# EAGLE design bristol_longshot (EAGLE 7.3.0)
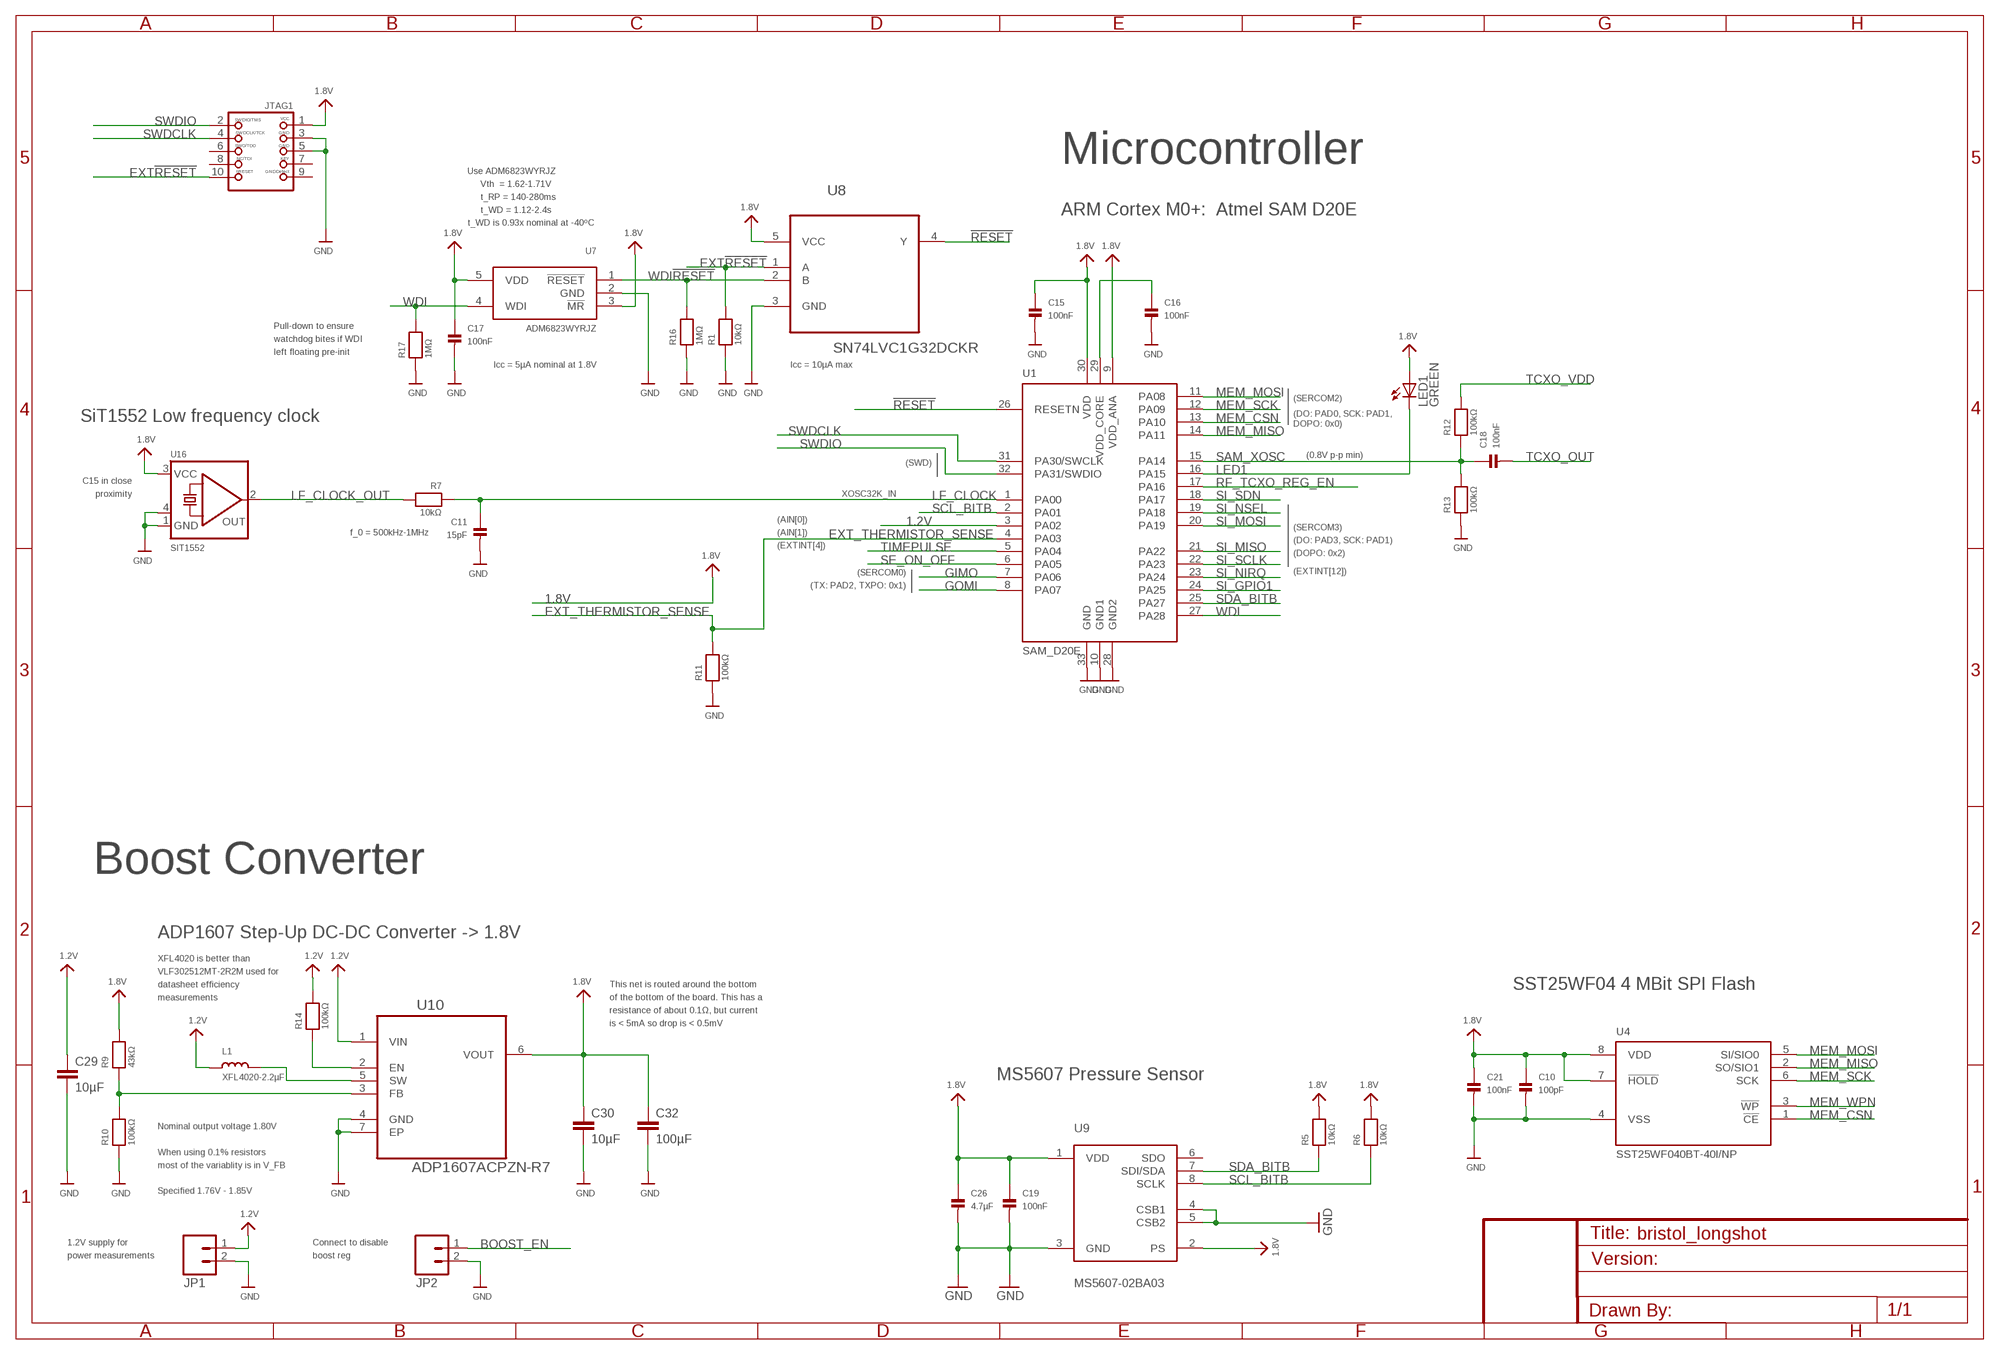
[diagram p0: schematic, sheet 1, part 1 of 2]
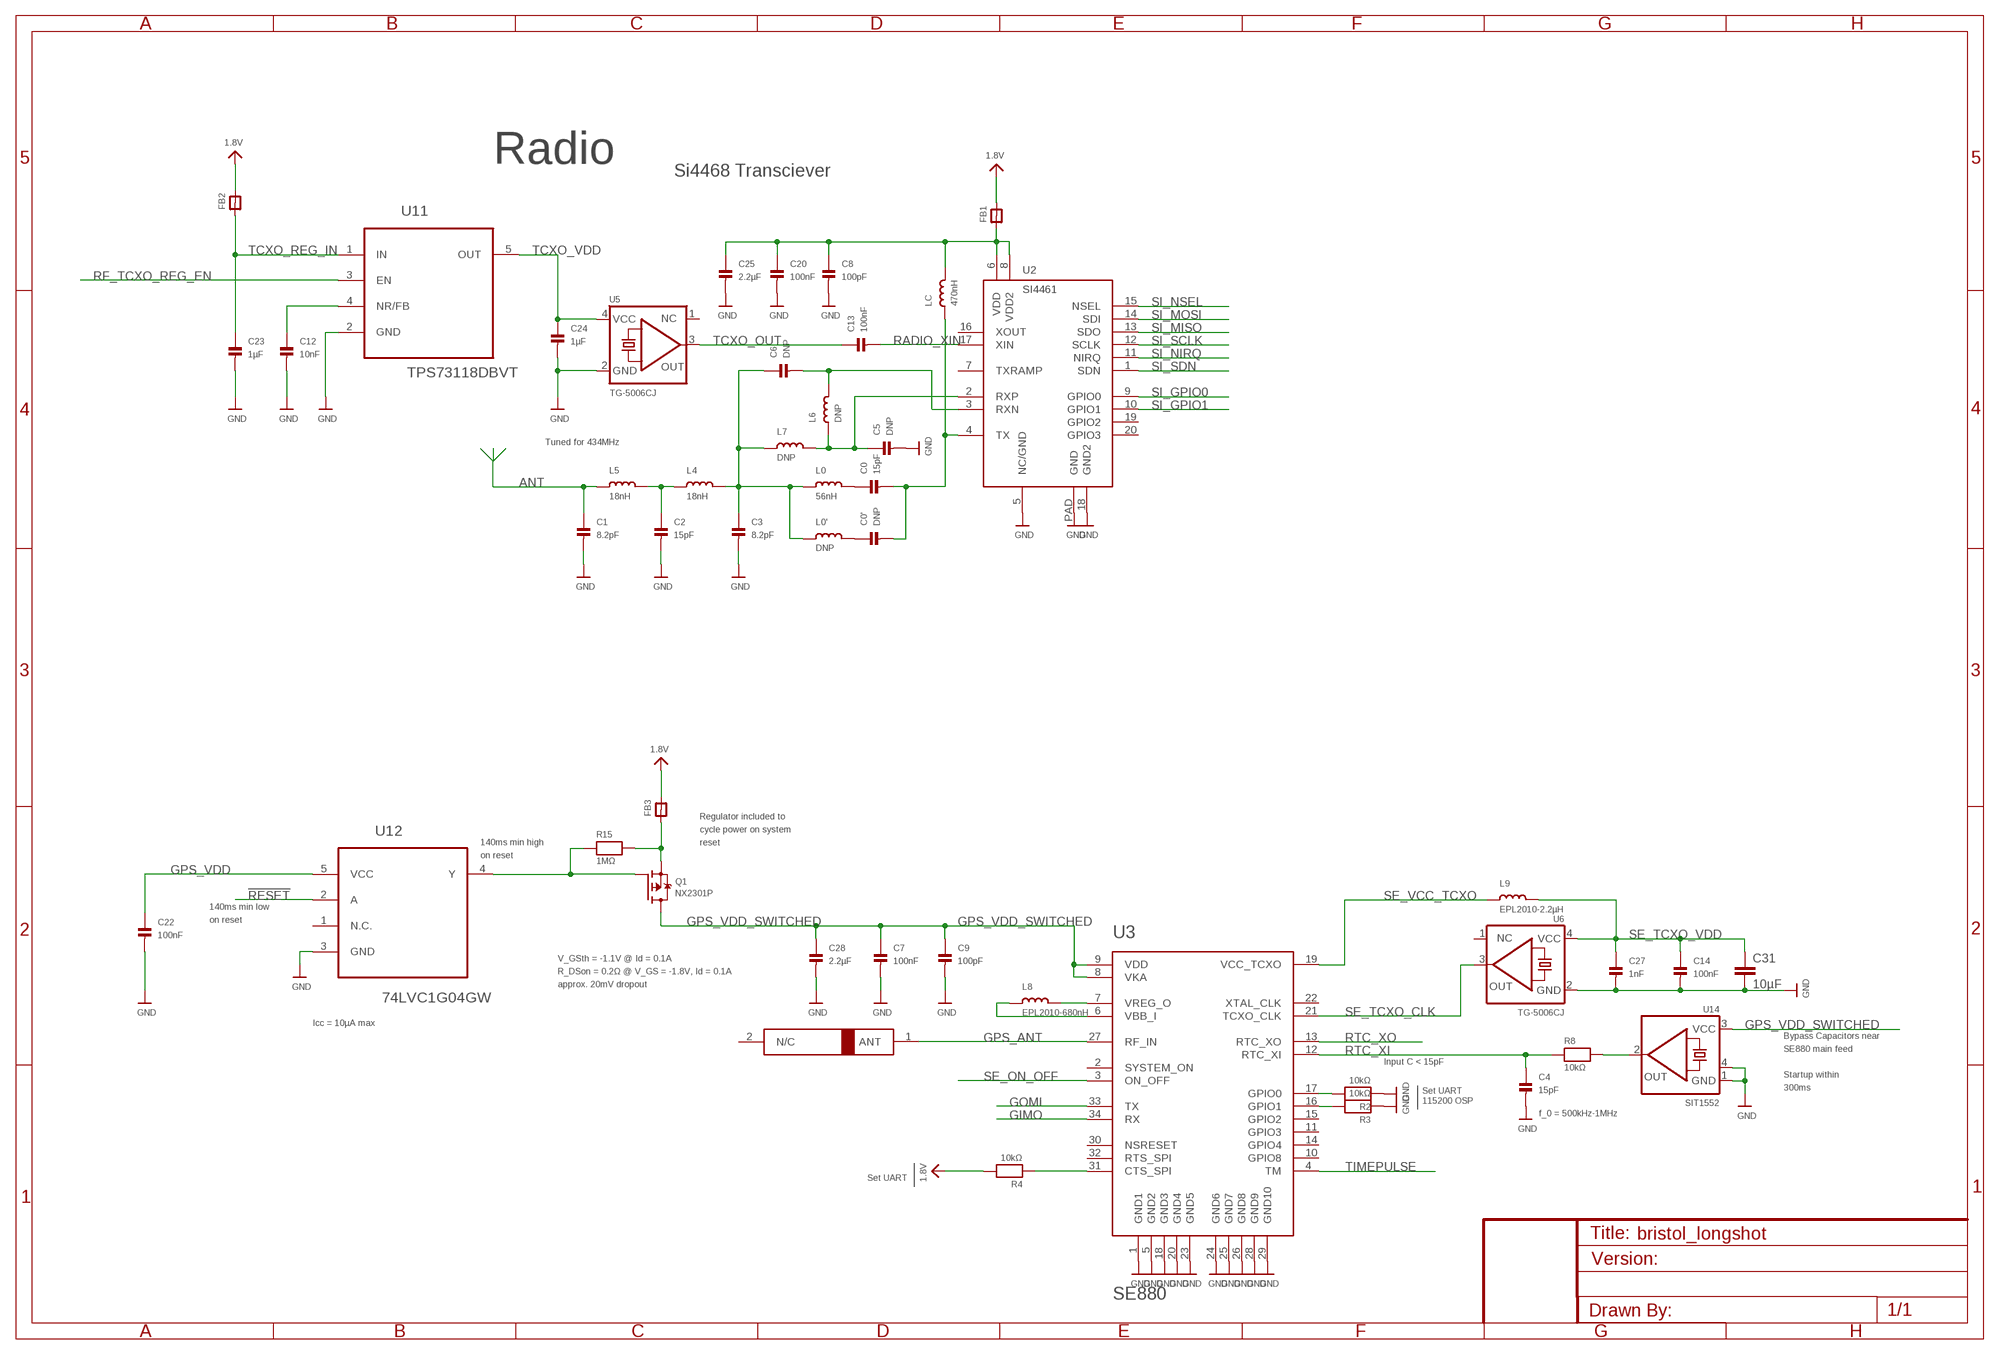
[diagram p1: schematic, sheet 1, part 2 of 2]

## Parts
A1  1575AT43A40  [1575AT43A40]
C0  15pF  CAP_CERAMIC_0402  [_0402]
C0'  DNP  CAP_CERAMIC_0402  [_0402]
C1  8.2pF  CAP_CERAMIC_0402  [_0402]
C2  15pF  CAP_CERAMIC_0402  [_0402]
C3  8.2pF  CAP_CERAMIC_0402  [_0402]
C4  15pF  CAP_CERAMIC_0402  [_0402]
C5  DNP  CAP_CERAMIC_0402  [_0402]
C6  DNP  CAP_CERAMIC_0402  [_0402]
C7  100nF  CAP_CERAMIC_0402  [_0402]
C8  100pF  CAP_CERAMIC_0402  [_0402]
C9  100pF  CAP_CERAMIC_0402  [_0402]
C10  100pF  CAP_CERAMIC_0402  [_0402]
C11  15pF  CAP_CERAMIC_0402  [_0402]
C12  10nF  CAP_CERAMIC_0402  [_0402]
C13  100nF  CAP_CERAMIC_0402  [_0402]
C14  100nF  CAP_CERAMIC_0402  [_0402]
C15  100nF  CAP_CERAMIC_0402  [_0402]
C16  100nF  CAP_CERAMIC_0402  [_0402]
C17  100nF  CAP_CERAMIC_0402  [_0402]
C18  100nF  CAP_CERAMIC_0402  [_0402]
C19  100nF  CAP_CERAMIC_0402  [_0402]
C20  100nF  CAP_CERAMIC_0402  [_0402]
C21  100nF  CAP_CERAMIC_0402  [_0402]
C22  100nF  CAP_CERAMIC_0402  [_0402]
C23  1µF  CAP_CERAMIC_0402  [_0402]
C24  1µF  CAP_CERAMIC_0402  [_0402]
C25  2.2µF  CAP_CERAMIC_0402  [_0402]
C26  4.7µF  CAP_CERAMIC_0402  [_0402]
C27  1nF  CAP_CERAMIC_0402  [_0402]
C28  2.2µF  CAP_CERAMIC_0402  [_0402]
C29  10µF  C-EUC0603K  [C0603K]
C30  10µF  C-EUC0603K  [C0603K]
C31  10µF  C-EUC0603K  [C0603K]
C32  100µF  C-EUC1206K  [C1206K]
FB1  FERRITE_0402  [_0402@1]
FB2  FERRITE_0402  [_0402@1]
FB3  FERRITE_0402  [_0402@1]
JP1  M02LOCK  [1X02_LOCK]
JP2  M02LOCK  [1X02_LOCK]
JTAG1  JTAG-CORTEXM3SMT  [2X05_1.27MM_SMT]
L0  56nH  INDUCTOR_0402  [_0402]
L0'  DNP  INDUCTOR_0402  [_0402]
L1  XFL4020-2.2µF  XFL4020  [XFL4020]
L4  18nH  INDUCTOR_0402  [_0402]
L5  18nH  INDUCTOR_0402  [_0402]
L6  DNP  INDUCTOR_0402  [_0402]
L7  DNP  INDUCTOR_0402  [_0402]
L8  EPL2010-680nH  EPL2010  [EPL2010]
L9  EPL2010-2.2µH  EPL2010  [EPL2010]
LC  470nH  INDUCTOR_0402  [_0402]
LED1  GREEN  LEDCHIPLED_0603  [CHIPLED_0603]
Q1  NX2301P  [SOT23]
R1  10kΩ  RESISTOR_0402  [_0402]
R2  10kΩ  RESISTOR_0402  [_0402]
R3  10kΩ  RESISTOR_0402  [_0402]
R4  10kΩ  RESISTOR_0402  [_0402]
R5  10kΩ  RESISTOR_0402  [_0402]
R6  10kΩ  RESISTOR_0402  [_0402]
R7  10kΩ  RESISTOR_0402  [_0402]
R8  10kΩ  RESISTOR_0402  [_0402]
R9  43kΩ  RESISTOR_0402  [_0402]
R10  100kΩ  RESISTOR_0402  [_0402]
R11  100kΩ  RESISTOR_0402  [_0402]
R12  100kΩ  RESISTOR_0402  [_0402]
R13  100kΩ  RESISTOR_0402  [_0402]
R14  100kΩ  RESISTOR_0402  [_0402]
R15  1MΩ  RESISTOR_0402  [_0402]
R16  1MΩ  RESISTOR_0402  [_0402]
R17  1MΩ  RESISTOR_0402  [_0402]
U1  SAM_D20E  [QFN32_5MM]
U2  SI4461  SI4060  [QFN20]
U3  SE880  [SE880]
U4  SST25WF040BT-40I/NP  [USON-8]
U5  TG-5006CJ  [TC-5006CJ]
U6  TG-5006CJ  [TC-5006CJ]
U7  ADM6823WYRJZ  TPS3123  [SOT23-5]
U8  SN74LVC1G32DCKR  [SOT65P210X110-5N]
U9  MS5607-02BA03  [MS5607-02BA03]
U10  ADP1607ACPZN-R7  [DFN200X200X60-7N]
U11  TPS73118DBVT  [SOT95P280X145-5N]
U12  74LVC1G04GW  [SOT65P210X110-5N]
U14  SIT1552  [SIT1552]
U16  SIT1552  [SIT1552]

## Nets
1.2V: C29.1 JP1.1 L1.1 R14.2 U1.3(PA02) U10.1(VIN)
1.8V: C10.1 C15.1 C17.1 C19.1 C21.1 C26.1 C30.1 C32.1 FB1.2 FB2.2 FB3.2 JTAG1.1 LED1.A R4.2 R5.2 R6.2 R9.2 U1.9(VDD_ANA) U1.30(VDD) U4.7(!HOLD) U4.8(VDD) U7.3(!MR) U7.5(VDD) U8.5(VCC) U9.1(VDD) U9.2(PS) U10.6(VOUT) U16.3(VCC)
!RESET: U1.26(RESETN) U8.4(Y) U12.2(A)
ANT: C1.1 L5.1
BOOST_EN: JP2.1 R14.1 U10.2(EN)
EXT!RESET: JTAG1.10 R1.2 U8.1(A)
EXT_THERMISTOR_SENSE: R11.2 U1.4(PA03)
FB: R9.1 R10.2 U10.3(FB)
FILTER1: C3.1 C6.1 L0'.1 L0.1 L4.2 L7.1
FILTER2: C2.1 L4.1 L5.2
GIMO: U1.7(PA06) U3.34(RX)
GND: C1.2 C2.2 C3.2 C4.2 C5.2 C7.2 C8.2 C9.2 C10.2 C11.2 C12.2 C14.2 C15.2 C16.2 C17.2 C19.2 C20.2 C21.2 C22.2 C23.2 C24.2 C25.2 C26.2 C27.2 C28.2 C29.2 C30.2 C31.2 C32.2 JP1.2 JP2.2 JTAG1.3 JTAG1.5 R1.1 R2.1 R3.1 R10.1 R11.1 R13.1 R16.1 R17.1 U1.10(GND1) U1.28(GND2) U1.33(GND) U2.5(NC/GND) U2.18(GND2) U2.PAD(GND) U3.1(GND1) U3.5(GND2) U3.18(GND3) U3.20(GND4) U3.23(GND5) U3.24(GND6) U3.25(GND7) U3.26(GND8) U3.28(GND9) U3.29(GND10) U4.4(VSS) U5.2(GND) U6.2(GND) U7.2(GND) U8.3(GND) U9.3(GND) U9.4(CSB1) U9.5(CSB2) U10.4(GND) U10.7(EP) U11.2(GND) U12.3(GND) U14.1(GND) U14.4(GND1) U16.1(GND) U16.4(GND1)
GOMI: U1.8(PA07) U3.33(TX)
GPS_ANT: A1.1(ANT) U3.27(RF_IN)
GPS_VDD: C22.1 FB3.1 Q1.2(S) R15.2 U12.5(VCC)
GPS_VDD_SWITCHED: C7.1 C9.1 C28.1 Q1.3(D) U3.8(VKA) U3.9(VDD) U14.3(VCC)
LED1: LED1.C U1.16(PA15)
LF_CLOCK: C11.1 R7.1 U1.1(PA00)
LF_CLOCK_OUT: R7.2 U16.2(OUT)
MEM_CSN: U1.13(PA10) U4.1(!CE)
MEM_MISO: U1.14(PA11) U4.2(SO/SIO1)
MEM_MOSI: U1.11(PA08) U4.5(SI/SIO0)
MEM_SCK: U1.12(PA09) U4.6(SCK)
MEM_WPN: U4.3(!WP)
N$5: C0'.1 L0'.2
RADIO_VDD: C8.1 C20.1 C25.1 FB1.1 LC.2 U2.6(VDD) U2.8(VDD2)
RADIO_XIN: C13.2 U2.17(XIN)
RESET: Q1.1(G) R15.1 U12.4(Y)
RF_OUT: C0'.2 C0.2 LC.1 U2.4(TX)
RF_TANK: C0.1 L0.2
RF_TCXO_REG_EN: U1.17(PA16) U11.3(EN)
RTC_XI: C4.1 R8.1 U3.12(RTC_XI)
RTC_XO: U3.13(RTC_XO)
RXN: C5.1 L6.1 L7.2 U2.2(RXP)
RXP: C6.2 L6.2 U2.3(RXN)
SAM_XOSC: C18.1 R12.1 R13.2 U1.15(PA14)
SCL_BITB: R6.1 U1.2(PA01) U9.8(SCLK)
SDA_BITB: R5.1 U1.25(PA27) U9.7(SDI/SDA)
SE800_LF_OUT: R8.2 U14.2(OUT)
SE_GPIO0: R2.2 U3.17(GPIO0)
SE_GPIO1: R3.2 U3.16(GPIO1)
SE_MODE_PULL: R4.1 U3.31(CTS_SPI)
SE_ON_OFF: U1.6(PA05) U3.3(ON_OFF)
SE_TCXO_CLK: U3.21(TCXO_CLK) U6.3(OUT)
SE_TCXO_VDD: C14.1 C27.1 C31.1 L9.2 U6.4(VCC)
SE_VBB: L8.1 U3.6(VBB_I)
SE_VCC_TCXO: L9.1 U3.19(VCC_TCXO)
SE_VREG: L8.2 U3.7(VREG_O)
SI_GPIO0: U2.9(GPIO0)
SI_GPIO1: U1.24(PA25) U2.10(GPIO1)
SI_MISO: U1.21(PA22) U2.13(SDO)
SI_MOSI: U1.20(PA19) U2.14(SDI)
SI_NIRQ: U1.23(PA24) U2.11(NIRQ)
SI_NSEL: U1.19(PA18) U2.15(NSEL)
SI_SCLK: U1.22(PA23) U2.12(SCLK)
SI_SDN: U1.18(PA17) U2.1(SDN)
SW: L1.2 U10.5(SW)
SWDCLK: JTAG1.4 U1.31(PA30/SWCLK)
SWDIO: JTAG1.2 U1.32(PA31/SWDIO)
TCXO_OUT: C13.1 C18.2 U5.3(OUT)
TCXO_REG_IN: C23.1 FB2.1 U11.1(IN)
TCXO_REG_NR: C12.1 U11.4(NR/FB)
TCXO_VDD: C24.1 R12.2 U5.4(VCC) U11.5(OUT)
TIMEPULSE: U1.5(PA04) U3.4(TM)
VDD_CORE: C16.1 U1.29(VDD_CORE)
WDI: R17.2 U1.27(PA28) U7.4(WDI)
WDI!RESET: R16.2 U7.1(!RESET) U8.2(B)
Unconnected: A1.2(N/C) JTAG1.6 JTAG1.7 JTAG1.8 JTAG1.9 U2.7(TXRAMP) U2.16(XOUT) U2.19(GPIO2) U2.20(GPIO3) U3.2(SYSTEM_ON) U3.10(GPIO8) U3.11(GPIO3) U3.14(GPIO4) U3.15(GPIO2) U3.22(XTAL_CLK) U3.30(NSRESET) U3.32(RTS_SPI) U5.1(NC) U6.1(NC) U9.6(SDO) U12.1(N.C.)

## Notes on the sheet
- Microcontroller | Radio
- Use ADM6823WYRJZ
- Si4468 Transciever
- Vth  = 1.62-1.71V
  t_RP = 140-280ms
  t_WD = 1.12-2.4s
- ARM Cortex M0+:  Atmel SAM D20E
- t_WD is 0.93x nominal at -40ºC
- Pull-down to ensure
  watchdog bites if WDI
  left floating pre-init
- Icc = 5µA nominal at 1.8V | Icc = 10µA max
- (SERCOM2)
- (DO: PAD0, SCK: PAD1,
  DOPO: 0x0)
- SiT1552 Low frequency clock
- Tuned for 434MHz
- (0.8V p-p min)
- (SWD)
- C15 in close
  proximity
- XOSC32K_IN
- (AIN[0])
- (SERCOM3)
- f_0 = 500kHz-1MHz | (AIN[1])
- (DO: PAD3, SCK: PAD1)
- (EXTINT[4])
- (DOPO: 0x2)
- (SERCOM0) | (EXTINT[12])
- (TX: PAD2, TXPO: 0x1)
- Regulator included to
  cycle power on system
  reset
- 140ms min high
  on reset
- Boost Converter
- 140ms min low
  on reset
- ADP1607 Step-Up DC-DC Converter -> 1.8V
- V_GSth = -1.1V @ Id = 0.1A
- R_DSon = 0.2Ω @ V_GS = -1.8V, Id = 0.1A
- SST25WF04 4 MBit SPI Flash | approx. 20mV dropout
- XFL4020 is better than
  VLF302512MT-2R2M used for
  datasheet efficiency
  measurements
- This net is routed around the bottom
  of the bottom of the board. This has a
  resistance of about 0.1Ω, but current
  is < 5mA so drop is < 0.5mV
- Icc = 10µA max
- Bypass Capacitors near
  SE880 main feed
- Input C < 15pF
- MS5607 Pressure Sensor
- Startup within
  300ms
- Set UART
  115200 OSP
- f_0 = 500kHz-1MHz
- Set UART
- Nominal output voltage 1.80V
  
  When using 0.1% resistors 
  most of the variablity is in V_FB
  
  Specified 1.76V - 1.85V
- 1.2V supply for
  power measurements
- Connect to disable
  boost reg

## Library data of the parts
A1 = 1575AT43A40:1575AT43A40
C0 C0' C1-C28 = microbuilder_v3:CAP_CERAMIC: Ceramic Capacitors 0402 - 0402 Surface Mount Capacitors 16pF 50V 5% [Digikey: 445-4899-2-ND] 18pF 50V 5% [Digikey: 490-1281-2-ND] 22pF 50V 5% [Digikey: 490-1283-2-ND] 68pF 50V 5% [Digikey: 490-1289-2-ND] 0.1uF 10V 10% [Digikey: 490-1318-2-ND] 1.0uF 6.3V 10% [Digikey: 490-1320-2-ND] 0603 - 0603 Surface Mount Capacitors 16 pF 50V 5% [Digikey: 445-5051-2-ND] 22 pF 50V [Digikey: PCC220ACVTR-ND] 33 pF 50V 5% [Digikey: 490-1415-1-ND] 56pF 50V 5% [Digikey: 490-1421-1-ND] 220pF 50V 5% [Digikey: 445-1285-1-ND] 680 pF 50V 2200 pF 50V 5% C0G [Digikey: 445-1297-1-ND] 5600 pF 100V 5% X7R [Digikey: 478-3711-1-ND] 0.1 µF 25V 10% [Digikey: PCC2277TR-ND] 0.22 µF 16V 10% X7R [Digikey: 445-1318-1-ND] 1.0 µF 25V 10% [Digikey: 445-5146-2-ND] 0603 - RF Specific 3pF 250V +/-0.1pF RF [Digikey: 712-1347-1-ND] 18 pF 250V 5% [Digikey: 478-3505-1-ND or 712-1322-1-ND] 56 pF 250V 5% C0G RF [Digikey: 490-4867-1-ND] 68 pF 250V RF [Digikey: 490-4868-1-ND] 0805 - 0805 Surface Mount Capacitors 220 pF 250V 2% RF Ceramic Capacitor [Digikey: 712-1398-1-ND] 1000 pF 50V 2% NP0 Ceramic Capacitor [Digikey: 478-3760-1-ND] 0.1 µF 25V 10% Ceramic Capacitor [Digikey: PCC1828TR-ND] 1.0 µF 16V 10% Ceramic Capacitor[Digikey: 490-1691-2-ND] 10.0 µF 10V 10% Ceramic Capacitor[Digikey: 709-1228-1-ND] 10.0 uF 16V 10% Ceramic Capacitor [Digikey: 478-5165-2-ND] 47 uF 6.3V 20% Ceramic Capacitor [Digikey: 587-1779-1-ND or 399-5506-1-ND] 1206 - 1206 Surface Mount Capacitors 47uF 10V 20% Ceramic Capacitor [Digikey: 490-5528-1-ND or 399-5508-1-ND or 445-6010-1-ND] 100uF 6.3V -20%, +80% Y5V Ceramic Capacitor (Digikey: 490-4512-1-ND, Mouser: 81-GRM31CF50J107ZE1L)
C29-C32 = resistor:C-EU: CAPACITOR, European symbol
FB1-FB3 = microbuilder_v3:FERRITE: Ferrite Bead 0603 MMZ1608B121C - 120 Ohm @ 100MHz, 600mA, 0.15 Ohm DC Resistance - Digikey: 445-2164-1-ND BK1608HW121-T - 120 Ohm, 600mA Ferrite Chip - Digikey: 587-1876-2-ND 0805 HZ0805B272R-10 - 2.7K Ohm @ 100MHz, 200mA, 0.8 Ohm DC Resistance - Digikey: 240-2504-1-ND (see also Murata BLM21BD272SN1L) MMZ2012Y152B - 1.5K Ohm @ 100MHz, 500mA, 0.4 Ohm DC Resistance - Digikey: 445-1560-1-ND - Mainly for high frequency (80-400MHz) MMZ2012R102A - 1K Ohm @ 100MHz, 500mA, 0.3 Ohm DC Resistance - Digikey: 445-1555-2-ND - More general purpose (10-200MHz)
JP1 JP2 = SparkFun:M02: Header 2 Standard 2-pin 0.1" header. Use with straight break away headers (SKU : PRT-00116), right angle break away headers (PRT-00553), swiss pins (PRT-00743), machine pins (PRT-00117), and female headers (PRT-00115). Molex polarized connector foot print use with SKU : PRT-08233 with associated crimp pins and housings.
JTAG1 = microbuilder_v3:JTAG-CORTEXM3: Serial Wire (SW-DP) Connector This standard 0.05" 10-pin connector is for use with the Cortex M0/M3's native SWD (serial wire debugger) interface (SW-DP). Some boards support a 20-pin combined JTAG+SWD connector (SWJ-DP), such as the LPC1700 family, but many smaller devices only work with SWD which typically use the smaller 10-pin SW-DP connecter (the LPC1300 family, for example, only supports SWD). 2x05 1.27mm/0.05" Connector: This is the standard SMT connector defined by ARM for all Cortex devices, and should be used in most situations and for forward-compatibility since any new devices coming to market will likely use this connector. MOLEX 10 Pin 0.1" Connector: This 0.1" 10 pin connector has the same pin layout as the standard 0.05" connector, but is easier to work with if you are using standard jumper wires or custom cables to connect your SWD hardware. MOLEX 20 Pin 0.1" Connector: This 0.1" 20 pin connector is the same model used for ARM7/ARM9 JTAG debuggers, but is connected to match the pins on the Segger J-Link for ARM (which supports both JTAG and SWD debugging). See the following document from ARM for more information on Cortex M3 Debug Connectors: http://infocenter.arm.com/help/topic/com.arm.doc.faqs/attached/13634/cortex_debug_connectors.pdf And the following page for an overview with images of the different connector types: http://www.keil.com/peripherals/coresight/connectors.asp
L0 L0' L4-L7 LC = microbuilder_v3:INDUCTOR: Inductors 0603: 10nH Ceramic Inductor - microwire antenna/RF (Digikey: 712-1434-2-ND) 0805: 560nH Ceramic Inductor - RF (Digikey: 553-1047-1-ND) 270nH Ceramic Inductor - Q = 40@250MHz, +-5%, 1 Ohm DC Resistance (Digikey: 535-10506-2-ND) 1007 (2518 Metric) SMT: 10µH 10% 250mOhm 820mA 1007 Inductor (Digikey: 587-2189-1-ND) 22µH 10% 500mOhm 580mA 1007 Inductor (Digikey: 587-2190-1-ND) 47µH 10% 950mOhm 420mA 1007 Inductor (Digikey: 587-2191-1-ND) 47µH 5% 100mOhm 1A 1008 Inductor (Digikey: 732-1816-1-ND) 5.0x5.0mm (Taiyo Yuden NR5040 Series) 6.8µH 20% 2.3A 64mOhm Inductor (Digikey: 587-2374-2-ND) 5.0x5.0mm (TDK VLC5045 Series) 4.7µH 20% 3.3A 34mOhm Inductor (Digikey: 445-6526-1-ND) 6.8µH 20% 2.7A 46mOhm Inductor (Digikey: 445-6527-1-ND) 6.0x6.0mm (TDK VLC6045 Series) 4.7µH 20% 3.8A 27mOhm Inductor (Digikey: 445-6538-2-ND) 6.8µH 20% 3A 41mOhm Inductor (Digikey: 445-6540-1-ND) 6.2µH 30% 2.2A 45mOhm Inductor (Digikey: SRR5028-6R2YCT-ND) - Not TDK VLC6045 but footprint should match 6.0x6.0mm (TDK SLF6045 Series) 6.8uH 30% 2A 33mOhm Inductor (Digikey: 445-4572-1-ND, Mouser: 810-SLF645T6R8N2R0PF)
L1 = Coilcraft_XAL:XFL4020
L8 L9 = Coilcraft_XAL:EPL2010
LED1 = led:LED: LED OSRAM: - CHIPLED LG R971, LG N971, LY N971, LG Q971, LY Q971, LO R971, LY R971 LH N974, LH R974 LS Q976, LO Q976, LY Q976 LO Q996 - Hyper CHIPLED LW Q18S LB Q993, LB Q99A, LB R99A - SideLED LS A670, LO A670, LY A670, LG A670, LP A670 LB A673, LV A673, LT A673, LW A673 LH A674 LY A675 LS A676, LA A676, LO A676, LY A676, LW A676 LS A679, LY A679, LG A679 - Hyper Micro SIDELED® LS Y876, LA Y876, LO Y876, LY Y876 LT Y87S - SmartLED LW L88C, LW L88S LB L89C, LB L89S, LG L890 LS L89K, LO L89K, LY L89K LS L896, LA L896, LO L896, LY L896 - TOPLED LS T670, LO T670, LY T670, LG T670, LP T670 LSG T670, LSP T670, LSY T670, LOP T670, LYG T670 LG T671, LOG T671, LSG T671 LB T673, LV T673, LT T673, LW T673 LH T674 LS T676, LA T676, LO T676, LY T676, LB T676, LH T676, LSB T676, LW T676 LB T67C, LV T67C, LT T67C, LS T67K, LO T67K, LY T67K, LW E67C LS E67B, LA E67B, LO E67B, LY E67B, LB E67C, LV E67C, LT E67C LW T67C LS T679, LY T679, LG T679 LS T770, LO T770, LY T770, LG T770, LP T770 LB T773, LV T773, LT T773, LW T773 LH T774 LS E675, LA E675, LY E675, LS T675 LS T776, LA T776, LO T776, LY T776, LB T776 LHGB T686 LT T68C, LB T68C - Hyper Mini TOPLED® LB M676 - Mini TOPLED Santana® LG M470 LS M47K, LO M47K, LY M47K Source: http://www.osram.convergy.de LUXEON: - LUMILED® LXK2-PW12-R00, LXK2-PW12-S00, LXK2-PW14-U00, LXK2-PW14-V00 LXK2-PM12-R00, LXK2-PM12-S00, LXK2-PM14-U00 LXK2-PE12-Q00, LXK2-PE12-R00, LXK2-PE12-S00, LXK2-PE14-T00, LXK2-PE14-U00 LXK2-PB12-K00, LXK2-PB12-L00, LXK2-PB12-M00, LXK2-PB14-N00, LXK2-PB14-P00, LXK2-PB14-Q00 LXK2-PR12-L00, LXK2-PR12-M00, LXK2-PR14-Q00, LXK2-PR14-R00 LXK2-PD12-Q00, LXK2-PD12-R00, LXK2-PD12-S00 LXK2-PH12-R00, LXK2-PH12-S00 LXK2-PL12-P00, LXK2-PL12-Q00, LXK2-PL12-R00 Source: www.luxeon.com KINGBRIGHT: KA-3528ASYC Source: www.kingbright.com
Q1 = nxp:NX2301P
R1-R17 = microbuilder_v3:RESISTOR: Resistors 0402 - 0402 Surface Mount Package 22 Ohm 1% 1/16W [Digikey: 311-22.0LRTR-ND] 33 Ohm 5% 1/16W 1.0K 5% 1/16W 1.5K 5% 1/16W 2.0K 1% 1/16W 10.0K 1% 1/16W [Digikey: 311-10.0KLRTR-ND] 10.0K 5% 1/16W [Digikey: RMCF0402JT10K0TR-ND] 12.1K 1% 1/16W [Digikey: 311-22.0LRTR-ND] 100.0K 5% 1/16W 0603 - 0603 Surface Mount Package 0 Ohm 1/10 Watt 1% Resistor 15 Ohm 1/10 Watt 1% Resistor 33 Ohm 1/10 Watt 1% Resistor 49.9 Ohm 1/10 Watt 1% Resistor 100 Ohm 1/10 Watt 1% Resistor 150 Ohm 1/10 Watt 1% Resistor 240 Ohm 1/10 Watt 1% Resistor 390 Ohm 1/10 Watt 1% Resistor 560 Ohm 1/10 Watt 1% Resistor 680 Ohm 1/10 Watt 1% Resistor 750 Ohm 1/10 Watt 1% Resistor 1.0K Ohm 1/10 Watt 1% Resistor 1.5K Ohm 1/10 Watt 1% Resistor 2.0K Ohm 1/10 Watt 1% Resistor 2.2K Ohm 1/10 Watt 1% Resistor 3.3K Ohm 1/10 Watt 1% Resistor 4.7K Ohm 1/10 Watt 1% Resistor 10.0K Ohm 1/10 Watt 1% Resistor 12.0K Ohm 1/10 Watt 1% Resistor 12.1K Ohm 1/10 Watt 1% Resistor 20.0K Ohm 1/10 Watt 1% Resistor 33.0K Ohm 1/10 Watt 1% Resistor 100.0K Ohm 1/10 Watt 1% Resistor 0805 - 0805 Surface Mount Package 0 Ohm 1/8 Watt 1% Resistor 33 Ohm 1/8 Watt 1% Resistor 100 Ohm 1/8 Watt 1% Resistor 150 Ohm 1/8 Watt 1% Resistor 200 Ohm 1/8 Watt 1% Resistor 240 Ohm 1/8 Watt 1% Resistor 330 Ohm 1/8 Watt 1% Resistor 390 Ohm 1/8 Watt 1% Resistor 470 Ohm 1/8 Watt 1% Resistor 1.0K Ohm 1/8 Watt 1% Resistor 1.5K Ohm 1/8 Watt 1% Resistor 2.0K Ohm 1/8 Watt 1% Resistor 4.7K Ohm 1/8 Watt 1% Resistor 5.1K Ohm 1/8 Watt 1% Resistor 5.6K Ohm 1/8 Watt 1% Resistor 10.0K Ohm 1/8 Watt 1% Resistor 22.0K Ohm 1/8 Watt 1% Resistor 33.0K Ohm 1/8 Watt 1% Resistor 100K Ohm 1/8 Watt 1% Resistor 1206 - 1206 Surface Mount Package 2012 - 2010 Surface Mount Package 0.11 Ohm 1/2 Watt 1% Resistor - Digikey: RHM.11UCT-ND
U1 = fbri:SAM_D20E
U2 = fbri:SI4060
U3 = fbri:SE880
U4 = fbri:SST25WF040BT-40I/NP
U5 U6 = fbri:TG-5006CJ
U7 = TPS3125:TPS3123
U8 = SN74LVC1G32DCKR:SN74LVC1G32DCKR: 2-INPUT POSITIVE-OR GATE; MPN: SN74LVC1G32DCKR; OC_FARNELL: 1470880; OC_NEWARK: 76C4094; PACKAGE: SC-70-5; SUPPLIER: Texas Instruments
U9 = MS5607-02BA03:MS5607-02BA03
U10 = ADP1607:ADP1607ACPZN-R7: IC BOOST, 0.8-3.3V, 2MHZ, 1.8-3.3V, 6LFCSP; MPN: ADP1607ACPZN-R7; OC_FARNELL: 2254940; OC_NEWARK: 54W6610; PACKAGE: 6LFCSP; SUPPLIER: ANALOG DEVICES
U11 = TPS73118DVBT:TPS73118DBVT: Cap-Free, NMOS, 150mA Low Dropout Regulator with Reverse Current Protection; MPN: TPS73118DBVT; OC_FARNELL: 1135388; OC_NEWARK: 87H2948; PACKAGE: SOT-23-5; SUPPLIER: Texas Instruments
U12 = 74LVC1G04GW_inverter:74LVC1G04GW: Single inverter; MPN: 74LVC1G04GW; OC_FARNELL: 1631683; OC_NEWARK: 03P2774; PACKAGE: SOT-5; SUPPLIER: NXP
U14 U16 = fbri:SIT1552

## Board
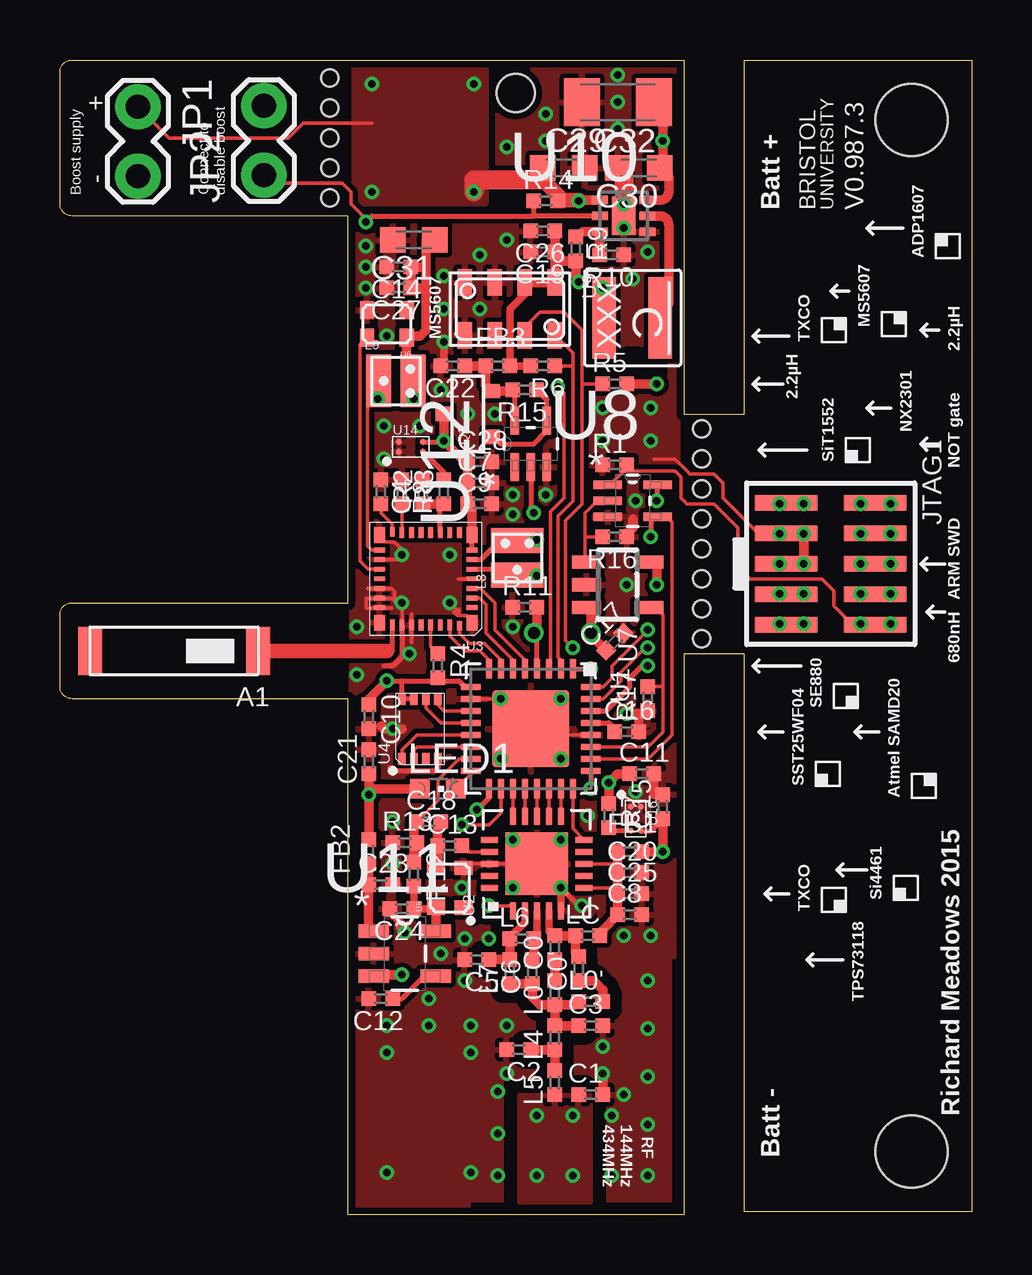
[diagram p2: board, top side]
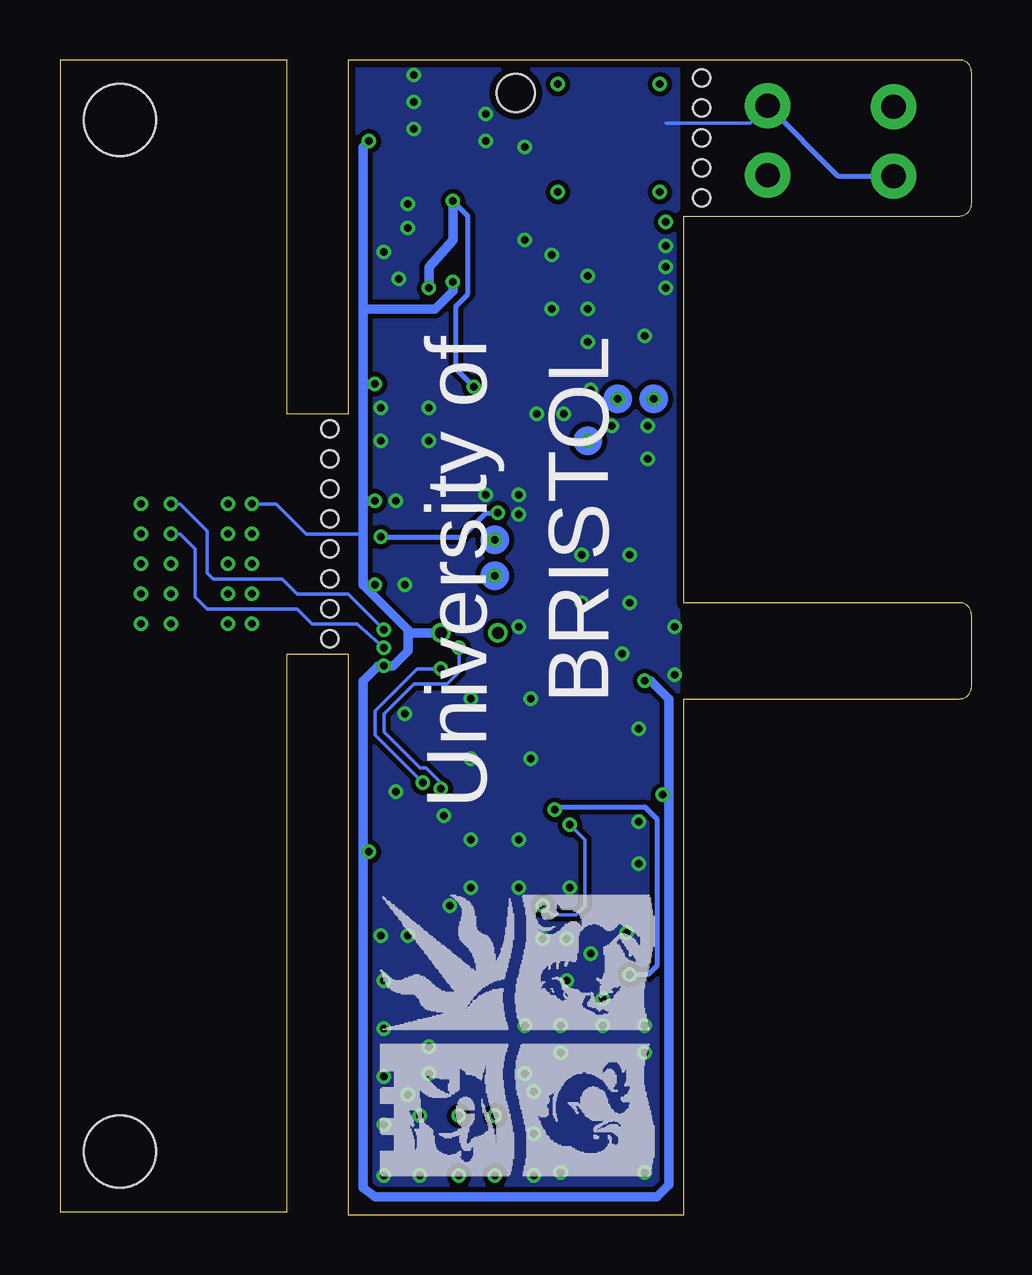
[diagram p3: board, bottom side, seen from below]

Size 38 x 48.12 mm. Coordinates in mm from the lower left corner, seen from the top.
Outline: 12,0 12,21.5 0.5,21.5 arc-90 0,22 0,25 arc-90 0.5,25.5 12,25.5 12,41.62 0.5,41.62 arc-90 0,42.12 0,47.62 arc-90 0.5,48.12 26,48.12 26,33.38 28.54,33.38 28.54,48.12 38,48.12 38,0.12 28.54,0.12 28.54,23.38 26,23.38 26,0 12,0
Copper layers (1*16): Top 0.035mm / dielectric 1.5mm / Bottom 0.035mm
Design rules "PCB-POOL Standard *": minimum track width 0.15mm, minimum drill 0.3mm, track to track 0.15mm, track to pad 0.15mm, pad to pad 0.15mm, via to via 0.15mm, smd to smd 0.15mm, copper to edge 0.3mm, drill to drill 0.2mm, minimum pad ring 0.2mm, minimum via ring 0.15mm, stop-mask expansion 0.075mm, vias tented up to drill 12mil, thermal gap 0.2mm
Holes 0.7 mm at 26.75,32.75 26.75,24 26.75,25.25 26.75,26.5 26.75,27.75 26.75,29 26.75,30.25 26.75,31.5 11.25,42.38 11.25,43.62 11.25,44.88 11.25,46.12 11.25,47.38
Holes 3 mm at 35.5,45.62 35.5,2.62
Holes 1.6 mm at 19,46.75
tRestrict: area 24.6,35.1 to 25.1,35.4; area 23.6,35.8 to 24.1,36

### Footprints (pad centres in the part's own frame; a part is rotated, then mirrored left to right if it is on the bottom)
1575AT43A40 = smd 1 x 2: 1 -3.5,0; 2 3.5,0
_0402 = smd 0.6 x 0.6: 1 -0.508,0; 2 0.508,0
C0603K = smd 1.05 x 1.08: 1 -0.875,0; 2 0.875,0
C1206K = smd 1.5 x 2: 1 -1.5,0; 2 1.5,0
_0402@1 = smd 0.6 x 0.6: 1 -0.508,0; 2 0.508,0
1X02_LOCK = drill 1.016 pad 1.88: 1 -0.178,0; 2 2.718,0
2X05_1.27MM_SMT = smd 0.65 x 2.6: 1 -2.54,-1.85; 2 -2.54,1.85; 3 -1.27,-1.85; 4 -1.27,1.85; 5 0,-1.85; 6 0,1.85; 7 1.27,-1.85; 8 1.27,1.85; 9 2.54,-1.85; 10 2.54,1.85
XFL4020 = smd 0.98 x 3.4: 1 -1.185,0; 2 1.138,0
EPL2010 = smd 1.04 x 2.2: 1 -0.725,0; 2 0.725,0
CHIPLED_0603 = smd 0.8 x 0.8: A 0,-0.75; C 0,0.75
SOT23 = smd 0.6 x 0.7: 1 -0.95,-1; 2 0.95,-1; 3 0,1
QFN32_5MM = smd 0.8 x 0.25: 1 -2.5,1.75; 2 -2.5,1.25; 3 -2.5,0.75; 4 -2.5,0.25; 5 -2.5,-0.25; 6 -2.5,-0.75; 7 -2.5,-1.25; 8 -2.5,-1.75; 17 2.5,-1.75; 18 2.5,-1.25; 19 2.5,-0.75; 20 2.5,-0.25; 21 2.5,0.25; 22 2.5,0.75; 23 2.5,1.25; 24 2.5,1.75 | smd 0.25 x 0.8: 9 -1.75,-2.5; 10 -1.25,-2.5; 11 -0.75,-2.5; 12 -0.25,-2.5; 13 0.25,-2.5; 14 0.75,-2.5; 15 1.25,-2.5; 16 1.75,-2.5; 25 1.75,2.5; 26 1.25,2.5; 27 0.75,2.5; 28 0.25,2.5; 29 -0.25,2.5; 30 -0.75,2.5; 31 -1.25,2.5; 32 -1.75,2.5 | smd 3.2 x 3.2: 33 0,0
QFN20 = smd 0.7 x 0.25: 1 -1.97,1; 2 -1.97,0.5; 3 -1.97,0; 4 -1.97,-0.5; 5 -1.97,-1; 11 1.97,-1; 12 1.97,-0.5; 13 1.97,0; 14 1.97,0.5; 15 1.97,1 | smd 0.25 x 0.7: 6 -1,-1.97; 7 -0.5,-1.97; 8 0,-1.97; 9 0.5,-1.97; 10 1,-1.97; 16 1,1.97; 17 0.5,1.97; 18 0,1.97; 19 -0.5,1.97; 20 -1,1.97 | smd 2.6 x 2.6: PAD 0,0
SE880 = smd 0.45 x 0.65: 1 -1.925,1.825; 9 -1.925,-1.825; 18 1.925,-1.825; 26 1.925,1.825 | smd 0.45 x 0.2: 2 -1.925,1.2; 3 -1.925,0.8; 4 -1.925,0.4; 5 -1.925,0; 6 -1.925,-0.4; 7 -1.925,-0.8; 8 -1.925,-1.2; 19 1.925,-1.2; 20 1.925,-0.8; 21 1.925,-0.4; 22 1.925,0; 23 1.925,0.4; 24 1.925,0.8; 25 1.925,1.2 | smd 0.2 x 0.45: 10 -1.4,-1.925; 11 -1,-1.925; 12 -0.6,-1.925; 13 -0.2,-1.925; 14 0.2,-1.925; 15 0.6,-1.925; 16 1,-1.925; 27 1.4,1.925; 28 1,1.925; 29 0.6,1.925; 30 0.2,1.925; 31 -0.2,1.925; 32 -0.6,1.925; 33 -1,1.925 | smd 0.2 x 0.39: 17 1.4,-1.955; 34 -1.4,1.955
USON-8 = smd 0.3 x 0.5: 1 -0.75,-1.25; 2 -0.25,-1.25; 3 0.25,-1.25; 4 0.75,-1.25; 5 0.75,1.25; 6 0.25,1.25; 7 -0.25,1.25; 8 -0.75,1.25
TC-5006CJ = smd 0.6 x 0.75: 1 -0.825,-0.565; 2 0.825,-0.565; 3 0.825,0.565; 4 -0.825,0.565
SOT23-5 = smd 0.55 x 1.2: 1 -0.95,-1.3; 2 0,-1.3; 3 0.95,-1.3; 4 0.95,1.3; 5 -0.95,1.3
SOT65P210X110-5N = smd 1.168 x 0.356: 1 -1.041,0.66; 2 -1.041,0; 3 -1.041,-0.66; 4 1.041,-0.66; 5 1.041,0.66
MS5607-02BA03 = smd 1.1 x 0.6: 1 -1.1,1.875; 2 -1.1,0.625; 3 -1.1,-0.625; 4 -1.1,-1.875; 5 1.1,-1.875; 6 1.1,-0.625; 7 1.1,0.625; 8 1.1,1.875
DFN200X200X60-7N = smd 0.66 x 0.356: 1 -0.991,0.66; 2 -0.991,0; 3 -0.991,-0.66; 4 0.991,-0.66; 5 0.991,0; 6 0.991,0.66 | smd 0.991 x 1.6: 7 0,0
SOT95P280X145-5N = smd 1.27 x 0.559: 1 -1.295,0.94; 2 -1.295,0; 3 -1.295,-0.94; 4 1.295,-0.94; 5 1.295,0.94
SOT65P210X110-5N' = smd 1.168 x 0.356: 1 -0.965,0.66; 2 -0.965,0; 3 -0.965,-0.66; 4 0.965,-0.66; 5 0.965,0.66
SIT1552 = smd 0.25 x 0.25: 1 -0.5,-0.205; 2 0.5,-0.205; 3 0.5,0.205; 4 -0.5,0.205

### Placement (x,y rotation side)
A1  4.75,23.5 180 top
C0  20.62,11.12 90 top
C0'  21.62,10.25 90 top
C1  22.12,5 0 top
C2  19.12,6.88 180 top
C3  22.12,7.88 0 top
C4  15.12,30.12 90 top
C5  17.38,10.62 180 top
C6  19.69,10.12 90 top
C7  17.5,30.5 0 top
C8  23.75,12.5 0 top
C9  17.5,29.62 0 top
C10  12.88,20.75 270 top
C11  24.25,18.38 0 top
C12  13.38,9 180 top
C13  16.25,15.38 0 top
C14  14.12,39.5 180 top
C15  25.12,17 90 top
C16  23.62,20.12 0 top
C17  23.12,23.88 45 top
C18  15.38,16.38 0 top
C19  20.12,40.12 180 top
C20  23.75,14.25 0 top
C21  12.88,18.88 90 top
C22  16.38,35.38 180 top
C23  13.38,13.75 0 top
C24  14.25,12.75 180 top
C25  23.75,13.38 0 top
C26  20.12,41 180 top
C27  14.12,38.62 180 top
C28  17.5,31.38 0 top
C29  21,43.62 0 top
C30  24.12,43.62 180 top
C31  14.75,40.62 180 top
C32  23.25,46.38 180 top
FB1  23.75,15.12 0 top
FB2  12.88,15.12 90 top
FB3  18.25,35.38 0 top
JP1  3.25,46 270 top
JP2  8.5,43.5 90 top
JTAG1  32.12,27.12 270 top
L0  20.62,9.25 90 top
L0'  22.12,8.88 0 top
L1  23.88,37.38 0 top
L4  20.62,7.38 90 top
L5  20.62,5.5 90 top
L6  19.25,11.5 0 top
L7  18.75,10.12 90 top
L8  19.06,27.38 90 top
L9  14,34.75 0 top
LC  22,11.62 0 top
LED1  15.75,17.75 270 top
Q1  17,33.38 90 top
R1  23.12,31.25 0 top
R2  13.38,30.12 270 top
R3  14.25,30.12 270 top
R4  15.75,22.88 270 top
R5  23.12,34.62 0 top
R6  20.12,35.38 180 top
R7  22.88,16.62 270 top
R8  16,30.12 90 top
R9  21.5,40.25 270 top
R10  23,40 180 top
R11  19.38,25.31 0 top
R12  14.75,14.19 270 top
R13  14.38,15.5 0 top
R14  20.25,42.25 0 top
R15  19.38,34.38 180 top
R16  23.12,28.25 180 top
R17  24.5,21.5 90 top
U1  19.62,20.25 270 top
U2  19.88,14.62 90 top
U3  15.25,26.5 180 top
U4  15,20.25 0 top
U5  16.25,13.62 90 top
U6  13.62,37.12 180 top
U7  23.25,26.25 270 top
U8  23.88,29.75 0 top
U9  18.75,37.75 270 top
U10  23.5,41.62 0 top
U11  14.38,10.88 0 top
U12  74LVC1G04GW  [SOT65P210X110-5N']  19.62,32.12 90 top
U14  14.62,32 0 top
U16  24,16.5 270 top

### Tracks (layer width: path | path; a pad name or v marks a point on that pad's centre or on a via)
1.2V  (via drill 0.3)
  Top 0.152: U1.3 20.44,22.94 20.44,29.31 21,29.88 21,34.25 v20.75,34.5 | JP1.1 4.55,44.88 9.5,44.88 10.12,45.5 13,45.5
  Top 0.2: 20.81,42.38 20.81,42.3 R14.2
  Top 0.4: v22.62,38.62 22.69,38.81 L1.1 | U10.1 21.66,42.28 v21.62,42.25 | 20.81,42.38 20.81,42.44
  Top 0.6: 21.66,42.28 20.96,42.28 20.81,42.44 20.12,43.12 20.25,43.38 C29.1
  Top 0.8: 20.12,43.12 17.25,43.12 v17.25,42.62
  Bottom 0.2: v20.75,34.5 21.5,35.25 21.5,37.88 21,38.38 21,41.62 v21.62,42.25
  Bottom 0.4: v22.62,38.62 22.62,39.5 21.62,40.62 v21.62,42.25
  other vias: 13,42.62 13,47.12 17.25,47.12
  pour Top (isolate 0.2): 12.25,48.12 17.75,48.12 17.75,42.12 12.25,42.12
1.8V  (via drill 0.3, 0.5)
  Top 0.152: R4.2 15.75,22.25 | 24.88,27.2 U7.5
  Top 0.2: U1.30 22.75,21 23.75,22 23.75,22.38 24.25,22.88 v24.5,22.88 | U1.9 16.88,22 16.62,22.25 15.75,22.25 14.25,22.25 | 24.55,27.3 U7.5 | U7.3 22,25.25 | v13.62,22.25 14.25,22.25 | U8.5 24.88,30.41 v24.88,29.75 | U4.7 U4.8 14.25,22.25 | U16.3 24.63,16 C15.1 | 25.12,46.12 24.75,46.12 C32.1
  Top 0.32: U9.2 19.38,38.38 18.75,37.75 FB3.2 | R6.2 FB3.2
  Top 0.4: 25.16,43.47 C30.1 | U10.6 25.04,42.28 arc90 25.38,42.62 25.38,43.25 arc90 C30.1 | C30.1 25.12,43.62 v25.12,44.75 25.12,46.12 | U9.2 U9.1 | v21.62,38.88 21.5,39.12 R9.2 20.63,39.74 C19.1 | FB2.2 v12.88,17.5 12.88,17.75 | LED1.A 12.88,17.75 | C21.1 12.88,17.75 | C10.1 12.88,21.5 v13.62,22.25 | U9.1 20.51,38.85 | 22.12,25.25 22,25.25 22.12,25.25 | 24.88,27.2 v24.88,26.25 | 22.12,25.25 v22.12,24.25 22.16,24.12 C17.1 | C26.1 C19.1 | U9.1 20.62,39.99 C19.1 | R5.2 v24.88,34.62 | C15.1 v25.12,15.12 FB1.2 | FB3.2 | v31,29.62 v30,29.62 30.04,29.66 JTAG1.1
  Bottom 0.152: 25.38,28.38 27.75,28.38 29,29.62 v30,29.62
  Bottom 0.4: 12.62,17.5 12.62,21.5 13.38,22.25 v13.62,22.25 | 12.62,17.5 v12.88,17.5 | v25.12,44.75 25.38,44.5 25.38,37.75 | 25.38,37.75 25.38,34.62 | 25.38,34.62 25.38,29.75 | 25.38,29.75 25.38,28.38 25.38,26.25 | v21.62,38.88 21.62,38.5 22.38,37.75 25.38,37.75 | 12.62,17.5 12.62,1.25 13.12,0.75 24.88,0.75 25.38,1.12 25.38,15.12 | 25.38,15.12 25.38,22.25 24.75,22.88 v24.5,22.88 24.12,22.88 23.5,23.5 23.5,24.25 | v24.88,29.75 25.38,29.75 | v24.88,26.25 25.38,26.25 | 25.38,26.25 23.5,24.38 23.5,24.25 | v22.12,24.25 23.5,24.25 | v24.88,34.62 25.38,34.62 | v25.12,15.12 25.38,15.12
!RESET  (via drill 0.3)
  Top 0.152: U1.26 24.5,19 25.5,20 25.5,28.88 25.29,29.09 U8.4 24.88,29.12
  Top 0.2: 19.69,29.43 v19.75,29.25 19.62,29.5 U12.2 | U8.4 24.62,29.09 v24.62,28.25
  Bottom 0.2: v24.62,28.25 21.25,28.25 20.25,29.25 v19.75,29.25
ANT  (via drill 0.3)
  other vias: 19.88,4.12 21.38,4.12 21.38,1.62 19.88,1.62
  pour Top: 19.12,0.5 22.12,0.5 22.12,5 19.12,5
BOOST_EN  (via drill 0.3)
  Top 0.152: v12.75,41.38 12.75,41.5 12.12,42.12 12.12,42.62 11.75,43 8.82,43 JP2.1
  Top 0.2: U10.2 19.75,41.62 | v12.75,41.38 13,41.62 19.75,41.62 | R14.1 19.74,41.63 19.75,41.62
EXT!RESET  (via drill 0.3)
  Top 0.152: 33.5,24.75 32.88,24.75 32.25,25.38 32.25,26 31.75,26.5 28.75,26.5 28.25,27 28.25,28.62 27.25,29.62 26.12,29.62 25.88,29.88 25.88,30.75 25.62,31 23.55,31 | 33.5,24.75 33.81,24.75 JTAG1.10 34.59,24.59 v34.62,24.62 | v33.38,24.62 33.5,24.75 | 23,30.38 22.87,30.38 U8.1 22.91,30.41 23.5,31 23.55,31 | 23.55,31 23.63,31.04 R1.2
EXT_THERMISTOR_SENSE  (via drill 0.5)
  Top 0.2: U1.4 19.88,24.12 v19.75,24.25
  Top 0.4: R11.2 19.88,24.38 v19.75,24.25
FB
  Top 0.4: R9.1 21.79,40.97 U10.3 22.49,40.95 R10.2 22.5,40.12 22.5,40.88
FILTER1
  Top 0.4: L0.1 | L0.1 20,8.75 19.69,9.06 C6.1 L7.1 | C3.1 L4.2 L0.1 | L0'.1 21.48,8.74 L0.1
FILTER2
  Top 0.4: L5.2 L4.1 C2.1
GIMO
  Top 0.152: U1.7 18.38,23.12 17.69,23.81 17.06,23.81 16.65,24.23 U3.34
GND  (via drill 0.3)
  Top 0.152: U1.10 v18.38,21.5 U1.33 19.62,21.5 v20.88,21.5 | 18.88,14.38 18.62,14.62 U2.18 16.88,14.62 | U1.28 21,20 21,19.12 v20.88,19 | 17.12,14.38 16.86,14.38 U5.2 | U2.PAD v20.88,15.62 | 13.32,28.3 U3.18 13.32,28.27 13.56,28.03 13.94,28.03 14.25,27.72 v14.25,27.5 14.05,27.3 U3.20 | v16.25,25.5 16.62,25.12 | 16.62,25.12 16.62,25.22 16.59,25.19 | 17.14,24.71 U3.1 17.11,24.79 16.94,24.97 16.56,24.97 16.41,25.12 16.62,25.12 | U3.5 16.59,26.5 | U3.28 v14.25,25.5 14.03,25.5 13.84,25.69 13.34,25.69 | 14.66,23.84 U3.29 | U3.29 | U3.29 14.66,25.03 | 12.81,26.09 13.81,26.09 13.94,25.97 13.94,25.72 | 13.34,25.69 12.75,25.69 12.75,25.31 12.78,25.28 13.81,25.28 | U3.24 13.34,25.69 | 30.25,28.38 JTAG1.3 30.3,28.38 v31,28.38 | v30,28.38 29.12,28.38 27.62,29.88 27.62,30.5 27.25,30.88 26.25,30.88 25.62,31.5 24.75,31.5
  Top 0.2: U3.28 14.25,23.25 13.88,22.88 13.5,22.88 | v20.88,13.62 21.62,12.88 v21.75,12.88 | U4.4 15.75,18.62 15.62,18.5 13.88,18.5 13.75,18.62
  Top 0.305: 18.88,14.38 v18.88,13.62 | U2.5 v20.88,13.62
  Top 0.32: C24.2 13.75,12.62 14.12,12.24 14.12,12 | 16,35.5 v16,36.38
  Top 0.4: 14.25,20.25 13.5,20.25 13.38,20.37 | v31,28.38 v31,27.12 JTAG1.5 v30,27.12 | 30.25,28.38 v30,28.38 | v22.62,5.88 C1.2 | 23.88,29 23.88,28.62 23.62,28.38 | C11.2 24.75,17.51 C15.2 | C16.2 24.13,20.88 v23.62,20.88
  Top 0.8: 23.5,43.38 v23.5,42.12
  Bottom 0.152: JP2.2 9.22,45.5 12.75,45.5
  Bottom 0.2: JP2.2 5.56,43.28 JP1.2
  other vias: 18.38,19 23,1.62 18.62,7.88 17.12,7.88 18.62,5.88 16.75,13.62 18.88,15.62 13.88,20.25 22.62,33.62 23.5,41.12 24.5,40.12 23.88,39 16,37.75 18.62,40.62 12.38,24.5 12.38,22.5 14.56,23.38 12.75,38.62 12.75,39.5 13.88,14.62 13.88,16.38 14.38,11.75 23,4.12 13.62,36.62 12.75,40.38 16,39.12 20.25,45.88 20.25,44.75 23.25,46.38 23.25,45.25 23.25,47.5 13.62,6.75 17.12,6.75 13.62,1.75 17.12,1.75 18.62,44.5 18.88,24.5 17.88,11.5 16.88,11.5 16.88,9.75 15.88,10.88 18.25,1.62 18.25,3.38 18.25,5.12 23.5,5 24.5,7.75 24.5,5.75 24.5,3.75 24.5,1.62 13.62,7.88 15.38,7.88 15.38,9 22.62,7 22,16.62 23.5,11.62 24.5,9.75 23.62,26.25 13.5,32.88 13.5,31.5 18.88,30 16.25,27.5 17.5,37.75 17.5,40 24,17.62 24.62,11.62 24.62,32.25 20.25,30 15,32.88 24.62,33.62 15.88,34.38 17,33.38 18.12,33.38 18.88,29.19 24,29.75 22.62,32.25
  pour Top (isolate 0.2): 12.25,41.38 18.25,41.38 18.25,48.12 25.75,48.12 25.75,10.75 22.5,10.75 22.5,12.88 17,12.88 17,0.12 12,0.12
  pour Bottom (isolate 0.2): 12.25,48.12 25.75,48.12 25.75,0.12 12.25,0.12
  pour Top (isolate 0.5): 17,12.88 22.5,12.88 22.5,10.75 25.75,10.75 25.75,0.12 22.88,0.12 22.88,5.75 18.38,5.75 18.38,0.12 17,0.12
GOMI
  Top 0.152: U3.33 16.25,24.12 16.88,23.5 17.5,23.5 17.88,23.12 U1.8
GPS_ANT
  Top 0.152: 13.88,23.88 13.62,23.62 13.62,23.5
  Top 0.2: U3.27 13.85,23.48 13.62,23.5
  Top 0.6: A1.1 13.62,23.5
GPS_VDD
  Top 0.2: U12.5 18.96,34.28
  Top 0.4: C22.1 FB3.1 17.74,34.58 Q1.2 18.82,34.33 R15.2 18.96,34.28
GPS_VDD_SWITCHED  (via drill 0.3)
  Top 0.2: U14.3 15.96,32.2 v16,32.25 | U3.8 U3.9
  Top 0.4: U3.9 17.18,29.44 C9.1 C7.1 C28.1 16.88,31.38 v16,32.25 Q1.3
LED1
  Top 0.152: U1.16 17.12,18.38 LED1.C
LF_CLOCK  (via drill 0.3)
  Top 0.2: U1.1 v22.12,22.75
  Top 0.4: R7.1 v22.88,18 v22.88,18.01 23.24,18.38 C11.1
  Bottom 0.152: v22.12,22.75 23.12,22.75 24.88,21 24.88,20 v22.88,18
LF_CLOCK_OUT
  Top 0.2: U16.2 22.99,16 R7.2
MEM_CSN
  Top 0.152: U1.13 14.88,20 14.25,19.38 U4.1
MEM_MISO
  Top 0.152: U1.14 14.88,19.5 14.75,19.38 U4.2
MEM_MOSI
  Top 0.152: U1.11 16,21 15.75,21.25 U4.5
MEM_SCK
  Top 0.152: U1.12 15.88,20.5 15.25,21.12 U4.6
N$1  (via drill 0.3)
  other vias: 31,25.88
N$2  (via drill 0.3)
  other vias: 30,25.88
N$3  (via drill 0.3)
  other vias: 30,24.62
N$4  (via drill 0.3)
  other vias: 31,24.62
N$5
  Top 0.4: C0'.1 22.26,9.74 22.62,9.38 22.62,8.76 L0'.2
N$6  (via drill 0.3)
  other vias: 34.62,25.88
N$7  (via drill 0.3)
  other vias: 34.62,27.12
N$10  (via drill 0.3)
  other vias: 33.38,25.88
N$11  (via drill 0.3)
  other vias: 33.38,27.12
RADIO_VDD
  Top 0.152: U2.8 23.25,14.62 23.25,14.26 C20.1 | U2.6 23.25,13.62 C25.1
  Top 0.4: LC.2 22.62,11.74 22.62,11.88 23.24,12.49 C8.1 C25.1 C20.1 FB1.1
RADIO_XIN
  Top 0.152: U2.17 17.01,15.12 C13.2
RESET
  Top 0.2: Q1.1 18.07,32.42 18.38,32.12 19.75,32.12 20.29,32.66 U12.4 20.29,33.97 R15.1
RF_OUT
  Top 0.32: U2.4 20.38,11.88 arc90 C0.2
  Top 0.4: C0.2 LC.1 21.49,10.89 C0'.2
RF_TANK
  Top 0.4: C0.1 L0.2
RF_TCXO_REG_EN  (via drill 0.3)
  Top 0.2: U1.17 17.88,17.38 v17.38,16.88
  Top 0.4: U11.3 13.14,10 v14.25,10
  Bottom 0.2: v17.38,16.88 17.25,17 13.62,17 13.12,16.5 13.12,10.38 13.5,10 v14.25,10
RTC_XI
  Top 0.2: U3.12 15.85,29.62 R8.1
  Top 0.4: C4.1 R8.1
RXN
  Top 0.32: U2.2 19.38,12.19 18.74,11.55 L6.1
  Top 0.4: L6.1 18.75,11.49 L7.2 C5.1
RXP
  Top 0.32: U2.3 19.88,11.62 L6.2
  Top 0.4: C6.2 19.76,10.7 L6.2
SAM_XOSC
  Top 0.152: U1.15 16.62,19 15.75,18.12 15.75,17.26 C18.1
  Top 0.4: 14.87,15.52 R13.2 14.75,15.63 | R12.1 14.75,15.63 | C18.1 14.75,16.26 14.75,15.63
SCL_BITB
  Top 0.152: U1.2 20.88,23.12 20.75,23.25 20.75,29.12 21.38,29.75 21.38,35.38 | 20.62,36.4 U9.8 21.38,35.9 21.38,35.38 | R6.1 21.38,35.38
SDA_BITB  (via drill 0.3)
  Top 0.152: v21.38,23.62 21.06,23.94 21.06,28.94 21.75,29.62 21.75,34.62 | 21.75,34.62 21.75,36.88 21,37.62 20,37.62 19.38,37 U9.7 19.5,36.52 | R5.1 21.75,34.62
  Top 0.2: U1.25 v22.12,17.75
  Bottom 0.152: v21.38,23.62 21.38,22.62 21.88,22.12 23.25,22.12 24.5,20.88 24.5,20.12 23,18.62 22.75,18.62 22.12,18 v22.12,17.75
SE800_LF_OUT
  Top 0.2: U14.2 16,30.92 R8.2
SE_GPIO0
  Top 0.152: U3.17 13.85,28.77 13.38,29.25 R2.2
SE_GPIO1
  Top 0.152: U3.16 R3.2
SE_MODE_PULL
  Top 0.152: U3.31 15.45,23.68 R4.1
SE_ON_OFF
  Top 0.152: U3.3 17.49,25.7 17.75,25.44 17.75,24.25 18.88,23.12 U1.6
SE_TCXO_CLK
  Top 0.152: U3.21 12.85,26.9 12.5,27.25 12.5,36.26 U6.3
SE_TCXO_VDD  (via drill 0.3)
  Top 0.4: L9.2 14.45,35.02 U6.4 14.52,36.62 15,36.62 15.25,36.88 15.25,38.62 | C14.1 C27.1 15.25,38.62 | C31.1 15.25,40.62 15.25,39.5 | 15.25,39.5 15.25,38.62 | C14.1 15.25,39.5
  Top 0.406: L9.2 14.75,34.75 v14.75,34
SE_VBB  (via drill 0.3)
  Top 0.2: U3.6 18.75,26.9 L8.1 19.06,26.62 v19.88,26.62
SE_VCC_TCXO  (via drill 0.3)
  Top 0.152: U3.19 12.99,27.7 12.81,27.88 12.81,33.81 13.28,34.27 L9.1
  Top 0.406: 13.28,34.27 13.25,34.27 v13.25,34
SE_VREG  (via drill 0.3)
  Top 0.2: U3.7 17.55,27.3 18.35,28.1 L8.2 19.12,28.1 19.12,28.12 v19.88,28.12
SI_GPIO1
  Top 0.152: 21.62,15.62 U2.10 21.38,16.09 U1.24
SI_MISO
  Top 0.152: U1.21 U2.13
SI_MOSI
  Top 0.152: U1.20 U2.14
SI_NIRQ
  Top 0.152: U1.23 U2.11
SI_NSEL
  Top 0.152: U1.19 U2.15
SI_SCLK
  Top 0.152: U1.22 U2.12
SI_SDN  (via drill 0.3)
  Top 0.152: 18.88,12.84 U2.1 18.88,12.88 v17.88,12.88 | v16.75,16.25 17.88,16.25 18.38,16.75 U1.18
  Bottom 0.152: v16.75,16.25 16.12,15.62 16.12,12.88 16.5,12.5 17.5,12.5 v17.88,12.88
SW
  Top 0.4: U10.5 25,41.62 arc-90 25.38,41.25 25.38,37.99 L1.2
SWDCLK  (via drill 0.3)
  Top 0.152: U1.31 22.62,21.5 23.38,22.25 23.38,22.62 24.38,23.62 v24.5,23.62 | JTAG1.4 33.25,28.39 32.98,28.39
  Top 0.2: v33.38,28.38 33.35,28.39 33.25,28.39 | v34.62,28.38 34.6,28.39 JTAG1.4
  Bottom 0.152: v24.5,23.62 25.62,24.62 27.5,24.62 28.12,25.25 31.88,25.25 32.38,25.75 32.38,27.75 33,28.38 v33.38,28.38
SWDIO  (via drill 0.3)
  Top 0.152: 33.88,29.82 JTAG1.2 | 22.38,22 U1.32 22.62,22 23,22.38 23,22.88 v24.5,24.38
  Top 0.2: v34.62,29.62 34.59,29.66 JTAG1.2 | 33.88,29.82 33.88,29.75 33.75,29.62 v33.38,29.62
  Bottom 0.152: v24.5,24.38 26,25.88 28.12,25.88 28.75,26.5 31.62,26.5 31.88,26.75 31.88,28.5 33,29.62 v33.38,29.62
TCXO_OUT
  Top 0.4: 15.69,14.88 U5.3 | C13.1 15.74,16.23 C18.2
  Top 0.406: C13.1 15.74,14.51 U5.3
TCXO_REG_IN
  Top 0.4: U11.1 12.87,12.03 C23.1 12.87,14.61 FB2.1
TCXO_REG_NR
  Top 0.2: C12.1 14.25,9 15.19,9.94 U11.4
TCXO_VDD
  Top 0.32: R12.2 C24.1 15.61,12.75 15.62,12.87
  Top 0.4: 15.62,12.87 U5.4 15.67,12.79 U11.5
TIMEPULSE
  Top 0.152: U3.4 17.52,26.1 18.12,25.5 18.12,24.38 19.38,23.12 U1.5
VDD_CORE
  Top 0.2: U1.29 22.88,20.5 23.12,20.26 C16.1
WDI
  Top 0.152: U1.27 24.5,19.5 25.12,20.12 25.12,21.75 25.12,22.01 | 25.12,22.01 25.12,25 24.82,25.3 U7.4 | R17.2 25.12,22.01
WDI!RESET
  Top 0.152: U7.1 21.68,27.2 21.88,27.25 21.88,28.25 | U8.2 22.38,29.75 21.88,29.25 21.88,28.25 | R16.2 21.88,28.25
(copper drawn outside any net)
  shapes: Bottom circle x5

### Text on the board
tPlace: + | - | Boost supply | Connect to / disable boost | Batt + | BRISTOL | UNIVERSITY | V0.987.3 | ADP1607 | MS5607 | MS5607 | TXCO | 2.2µH | 2.2µH | NX2301 | SiT1552 | NOT gate | ARM SWD | 680nH | SE880 | SST25WF04 | Atmel SAMD20 | Si4461 | TXCO | TPS73118 | 144MHz / 434MHz | Richard Meadows 2015 | RF | Batt -
bPlace: University of / BRISTOL